# EAGLE design XC95144 (EAGLE 5.11)
PROJECT: XC95144XL Breakout Board
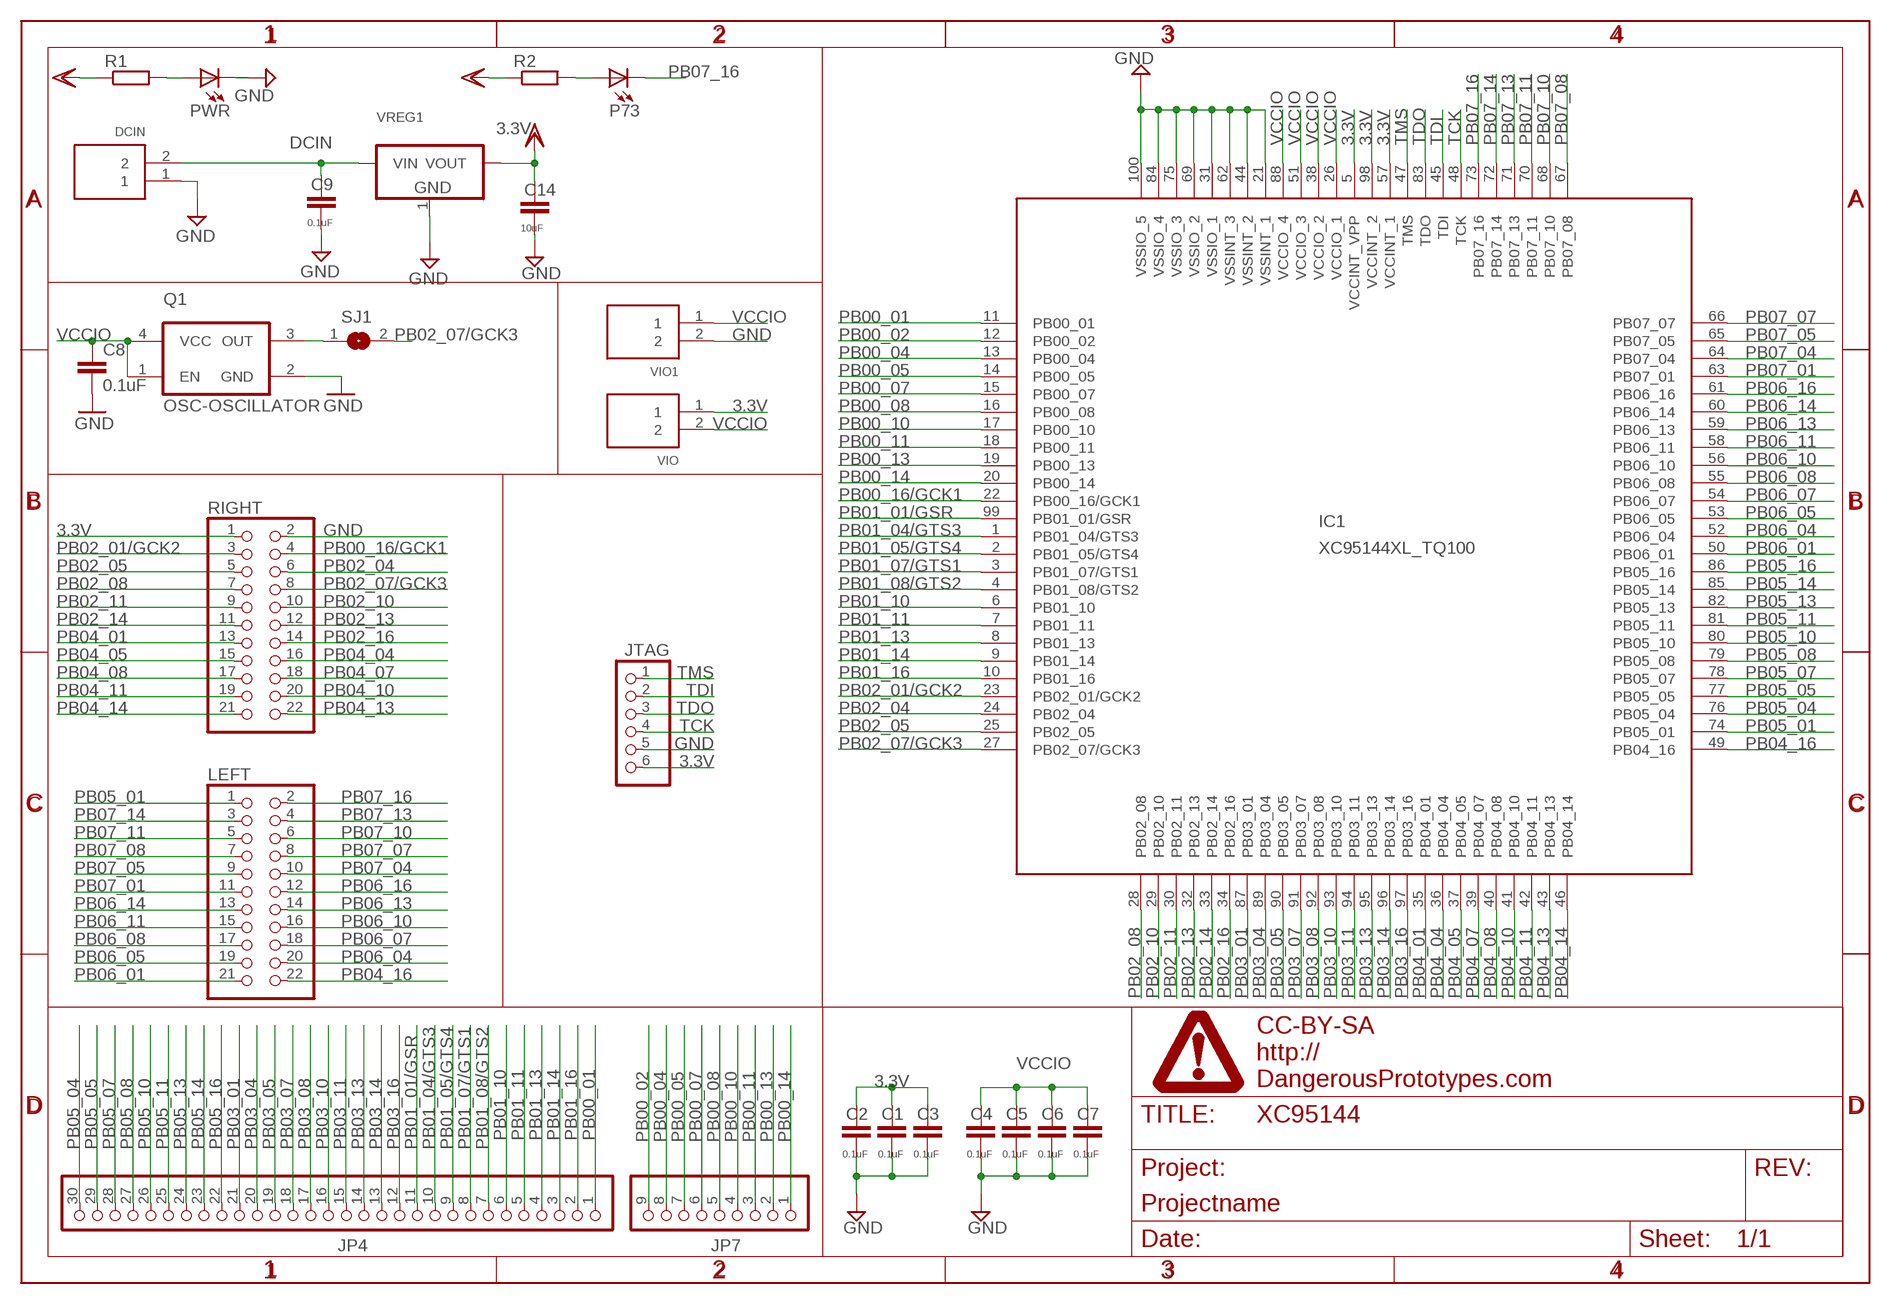
[diagram p0: schematic, sheet 1]

## Parts
C1  0.1uF  CAPC603  [C603]
C2  0.1uF  CAPC603  [C603]
C3  0.1uF  CAPC603  [C603]
C4  0.1uF  CAPC603  [C603]
C5  0.1uF  CAPC603  [C603]
C6  0.1uF  CAPC603  [C603]
C7  0.1uF  CAPC603  [C603]
C8  0.1uF  CAPC603  [C603]
C9  0.1uF  CAPC603  [C603]
C14  10uF  CAPC603  [C603]
DCIN  HEADER1X2PTH  [M1X2]
IC1  XC95144XL_TQ100  [XC-TQ100]
JP4  PINHD-1X30  [1X30]
JP7  PINHD-1X9  [1X09]
JTAG  PINHD-1X6  [1X06]
LEFT  PINHD-2X11  [2X11]
P73  P4  LEDCHIP-LED0805  [CHIP-LED0805]
PWR  P4  LEDCHIP-LED0805  [CHIP-LED0805]
Q1  OSC-OSCILLATOR  [OSCILLATOR_7X5_SMD]
R1  RESISTORR603  [R603]
R2  RESISTORR603  [R603]
RIGHT  PINHD-2X11  [2X11]
SJ1  SJ  [SJ]
U$1  DINA4_L  [DP_LOGO]
VIO  HEADER1X2PTH  [M1X2]
VIO1  HEADER1X2PTH  [M1X2]
VREG1  LD1117-3.3SOT223  [SOT223]

## Nets
3.3V: C1.1 C2.1 C3.1 C14.1 IC1.5(VCCINT_VPP) IC1.57(VCCINT_1) IC1.98(VCCINT_2) JTAG.6 R1.1 R2.1 RIGHT.1 VIO.1 VREG1.2(VOUT) ; supply symbol labelled VDD
DCIN: C9.1 DCIN.2 VREG1.3(VIN)
GND: C1.2 C2.2 C3.2 C4.2 C5.2 C6.2 C7.2 C8.2 C9.2 C14.2 DCIN.1 IC1.21(VSSINT_1) IC1.31(VSSIO_1) IC1.44(VSSINT_2) IC1.62(VSSINT_3) IC1.69(VSSIO_2) IC1.75(VSSIO_3) IC1.84(VSSIO_4) IC1.100(VSSIO_5) JTAG.5 PWR.C Q1.2(GND) RIGHT.2 VIO1.2 VREG1.1(GND)
N$1: PWR.A R1.2
N$2: P73.A R2.2
N$5: Q1.3(OUT) SJ1.1
PB00_01: IC1.11(PB00_01) JP4.1
PB00_02: IC1.12(PB00_02) JP7.9
PB00_04: IC1.13(PB00_04) JP7.8
PB00_05: IC1.14(PB00_05) JP7.7
PB00_07: IC1.15(PB00_07) JP7.6
PB00_08: IC1.16(PB00_08) JP7.5
PB00_10: IC1.17(PB00_10) JP7.4
PB00_11: IC1.18(PB00_11) JP7.3
PB00_13: IC1.19(PB00_13) JP7.2
PB00_14: IC1.20(PB00_14) JP7.1
PB00_16/GCK1: IC1.22(PB00_16/GCK1) RIGHT.4
PB01_01/GSR: IC1.99(PB01_01/GSR) JP4.11
PB01_04/GTS3: IC1.1(PB01_04/GTS3) JP4.10
PB01_05/GTS4: IC1.2(PB01_05/GTS4) JP4.9
PB01_07/GTS1: IC1.3(PB01_07/GTS1) JP4.8
PB01_08/GTS2: IC1.4(PB01_08/GTS2) JP4.7
PB01_10: IC1.6(PB01_10) JP4.6
PB01_11: IC1.7(PB01_11) JP4.5
PB01_13: IC1.8(PB01_13) JP4.4
PB01_14: IC1.9(PB01_14) JP4.3
PB01_16: IC1.10(PB01_16) JP4.2
PB02_01/GCK2: IC1.23(PB02_01/GCK2) RIGHT.3
PB02_04: IC1.24(PB02_04) RIGHT.6
PB02_05: IC1.25(PB02_05) RIGHT.5
PB02_07/GCK3: IC1.27(PB02_07/GCK3) RIGHT.8 SJ1.2
PB02_08: IC1.28(PB02_08) RIGHT.7
PB02_10: IC1.29(PB02_10) RIGHT.10
PB02_11: IC1.30(PB02_11) RIGHT.9
PB02_13: IC1.32(PB02_13) RIGHT.12
PB02_14: IC1.33(PB02_14) RIGHT.11
PB02_16: IC1.34(PB02_16) RIGHT.14
PB03_01: IC1.87(PB03_01) JP4.21
PB03_04: IC1.89(PB03_04) JP4.20
PB03_05: IC1.90(PB03_05) JP4.19
PB03_07: IC1.91(PB03_07) JP4.18
PB03_08: IC1.92(PB03_08) JP4.17
PB03_10: IC1.93(PB03_10) JP4.16
PB03_11: IC1.94(PB03_11) JP4.15
PB03_13: IC1.95(PB03_13) JP4.14
PB03_14: IC1.96(PB03_14) JP4.13
PB03_16: IC1.97(PB03_16) JP4.12
PB04_01: IC1.35(PB04_01) RIGHT.13
PB04_04: IC1.36(PB04_04) RIGHT.16
PB04_05: IC1.37(PB04_05) RIGHT.15
PB04_07: IC1.39(PB04_07) RIGHT.18
PB04_08: IC1.40(PB04_08) RIGHT.17
PB04_10: IC1.41(PB04_10) RIGHT.20
PB04_11: IC1.42(PB04_11) RIGHT.19
PB04_13: IC1.43(PB04_13) RIGHT.22
PB04_14: IC1.46(PB04_14) RIGHT.21
PB04_16: IC1.49(PB04_16) LEFT.22
PB05_01: IC1.74(PB05_01) LEFT.1
PB05_04: IC1.76(PB05_04) JP4.30
PB05_05: IC1.77(PB05_05) JP4.29
PB05_07: IC1.78(PB05_07) JP4.28
PB05_08: IC1.79(PB05_08) JP4.27
PB05_10: IC1.80(PB05_10) JP4.26
PB05_11: IC1.81(PB05_11) JP4.25
PB05_13: IC1.82(PB05_13) JP4.24
PB05_14: IC1.85(PB05_14) JP4.23
PB05_16: IC1.86(PB05_16) JP4.22
PB06_01: IC1.50(PB06_01) LEFT.21
PB06_04: IC1.52(PB06_04) LEFT.20
PB06_05: IC1.53(PB06_05) LEFT.19
PB06_07: IC1.54(PB06_07) LEFT.18
PB06_08: IC1.55(PB06_08) LEFT.17
PB06_10: IC1.56(PB06_10) LEFT.16
PB06_11: IC1.58(PB06_11) LEFT.15
PB06_13: IC1.59(PB06_13) LEFT.14
PB06_14: IC1.60(PB06_14) LEFT.13
PB06_16: IC1.61(PB06_16) LEFT.12
PB07_01: IC1.63(PB07_01) LEFT.11
PB07_04: IC1.64(PB07_04) LEFT.10
PB07_05: IC1.65(PB07_05) LEFT.9
PB07_07: IC1.66(PB07_07) LEFT.8
PB07_08: IC1.67(PB07_08) LEFT.7
PB07_10: IC1.68(PB07_10) LEFT.6
PB07_11: IC1.70(PB07_11) LEFT.5
PB07_13: IC1.71(PB07_13) LEFT.4
PB07_14: IC1.72(PB07_14) LEFT.3
PB07_16: IC1.73(PB07_16) LEFT.2 P73.C
TCK: IC1.48(TCK) JTAG.4
TDI: IC1.45(TDI) JTAG.2
TDO: IC1.83(TDO) JTAG.3
TMS: IC1.47(TMS) JTAG.1
VCCIO: C4.1 C5.1 C6.1 C7.1 C8.1 IC1.26(VCCIO_1) IC1.38(VCCIO_2) IC1.51(VCCIO_3) IC1.88(VCCIO_4) Q1.1(EN) Q1.4(VCC) VIO1.1 VIO.2

## Library data of the parts
C1-C9 C14 = dp_devices:CAP
DCIN VIO VIO1 = dp_devices:HEADER1X2
IC1 = XC:XC95144XL_TQ100: xc95144xl_tq100 edit this description Auto generated by make-symbol-device-package-bsdl.ulp Rev. 34 Source: xc95144xl_tq100.bsd
JP4 = pinhead:PINHD-1X30: PIN HEADER
JP7 = pinhead:PINHD-1X9: PIN HEADER
JTAG = pinhead:PINHD-1X6: PIN HEADER
LEFT RIGHT = pinhead:PINHD-2X11: PIN HEADER
P73 PWR = led:LED: LED OSRAM: - CHIPLED LG R971, LG N971, LY N971, LG Q971, LY Q971, LO R971, LY R971 LH N974, LH R974 LS Q976, LO Q976, LY Q976 LO Q996 - Hyper CHIPLED LW Q18S LB Q993, LB Q99A, LB R99A - SideLED LS A670, LO A670, LY A670, LG A670, LP A670 LB A673, LV A673, LT A673, LW A673 LH A674 LY A675 LS A676, LA A676, LO A676, LY A676, LW A676 LS A679, LY A679, LG A679 - Hyper Micro SIDELED® LS Y876, LA Y876, LO Y876, LY Y876 LT Y87S - SmartLED LW L88C, LW L88S LB L89C, LB L89S, LG L890 LS L89K, LO L89K, LY L89K LS L896, LA L896, LO L896, LY L896 - TOPLED LS T670, LO T670, LY T670, LG T670, LP T670 LSG T670, LSP T670, LSY T670, LOP T670, LYG T670 LG T671, LOG T671, LSG T671 LB T673, LV T673, LT T673, LW T673 LH T674 LS T676, LA T676, LO T676, LY T676, LB T676, LH T676, LSB T676, LW T676 LB T67C, LV T67C, LT T67C, LS T67K, LO T67K, LY T67K, LW E67C LS E67B, LA E67B, LO E67B, LY E67B, LB E67C, LV E67C, LT E67C LW T67C LS T679, LY T679, LG T679 LS T770, LO T770, LY T770, LG T770, LP T770 LB T773, LV T773, LT T773, LW T773 LH T774 LS E675, LA E675, LY E675, LS T675 LS T776, LA T776, LO T776, LY T776, LB T776 LHGB T686 LT T68C, LB T68C - Hyper Mini TOPLED® LB M676 - Mini TOPLED Santana® LG M470 LS M47K, LO M47K, LY M47K Source: http://www.osram.convergy.de LUXEON: - LUMILED® LXK2-PW12-R00, LXK2-PW12-S00, LXK2-PW14-U00, LXK2-PW14-V00 LXK2-PM12-R00, LXK2-PM12-S00, LXK2-PM14-U00 LXK2-PE12-Q00, LXK2-PE12-R00, LXK2-PE12-S00, LXK2-PE14-T00, LXK2-PE14-U00 LXK2-PB12-K00, LXK2-PB12-L00, LXK2-PB12-M00, LXK2-PB14-N00, LXK2-PB14-P00, LXK2-PB14-Q00 LXK2-PR12-L00, LXK2-PR12-M00, LXK2-PR14-Q00, LXK2-PR14-R00 LXK2-PD12-Q00, LXK2-PD12-R00, LXK2-PD12-S00 LXK2-PH12-R00, LXK2-PH12-S00 LXK2-PL12-P00, LXK2-PL12-Q00, LXK2-PL12-R00 Source: www.luxeon.com KINGBRIGHT: KA-3528ASYC Source: www.kingbright.com
Q1 = dp_devices:OSC-OSCILLATOR: Oscillator
R1 R2 = dp_devices:RESISTOR
SJ1 = jumper:SJ: SMD solder JUMPER
U$1 = dp_devices:DINA4_L: A4 DP frame Standard Dangerous Prototypes schematic frame. Automagically adds the DP logo and standard texts to the PCB Use the atrribute in the schematic editor to change the fields.; FF1: fulfillment by; FF2: Seeed Studio; FF3: www.seeedstudio.com; LICENSE: CC-BY-SA; PROJECT: Projectname; URL1: http://; URL2: DangerousPrototypes.com
VREG1 = dp_devices:LD1117-3.3

## Board
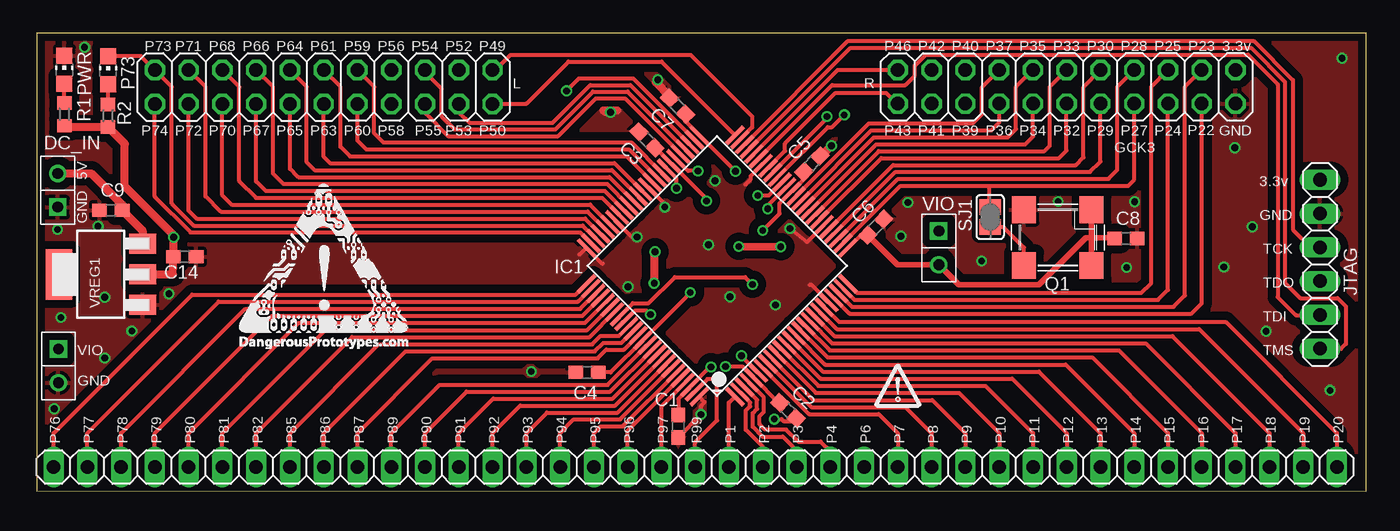
[diagram p1: board, top side]
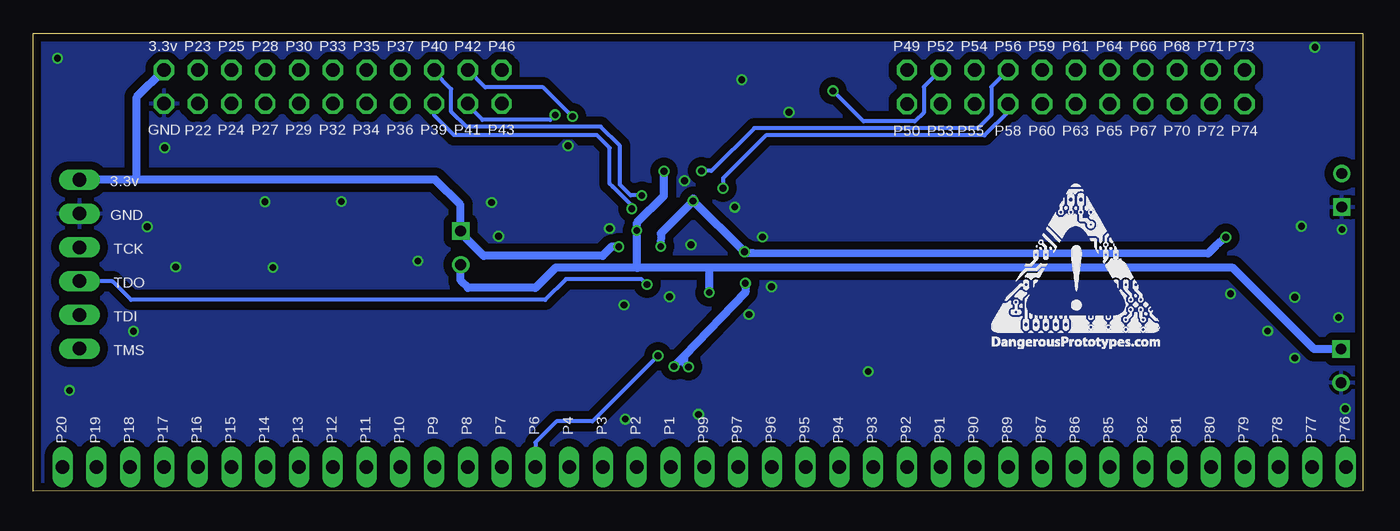
[diagram p2: board, bottom side, seen from below]

Size 100 x 34.43 mm. Coordinates in mm from the lower left corner, seen from the top.
Outline: 0.03,0.04 100,0 100,34.43 0,34.43 0.03,0.04
Copper layers (1*16): Top 0.035mm / dielectric 1.5mm / Bottom 0.035mm
Design rules "Fusion_eagle_rule_v1.1 *": minimum track width 6mil, minimum drill 12mil, track to track 6mil, track to pad 6mil, pad to pad 6mil, via to via 6mil, smd to smd 6mil, copper to edge 10mil, drill to drill 10mil, minimum pad ring 10mil, minimum via ring 6mil, stop-mask expansion 2mil, vias tented up to drill 100mil, thermal gap 10mil

### Footprints (pad centres in the part's own frame; a part is rotated, then mirrored left to right if it is on the bottom)
C603 = smd 1.1 x 1: 1 -0.85,0; 2 0.85,0
M1X2 = drill 0.8 square: 1 -1.27,0 | drill 0.8 round: 2 1.27,0
XC-TQ100 = smd 1.8 x 0.3: 1 -7.9,6; 2 -7.9,5.5; 3 -7.9,5; 4 -7.9,4.5; 5 -7.9,4; 6 -7.9,3.5; 7 -7.9,3; 8 -7.9,2.5; 9 -7.9,2; 10 -7.9,1.5; 11 -7.9,1; 12 -7.9,0.5; 13 -7.9,0; 14 -7.9,-0.5; 15 -7.9,-1; 16 -7.9,-1.5; 17 -7.9,-2; 18 -7.9,-2.5; 19 -7.9,-3; 20 -7.9,-3.5; 21 -7.9,-4; 22 -7.9,-4.5; 23 -7.9,-5; 24 -7.9,-5.5; 25 -7.9,-6; 51 7.9,-6; 52 7.9,-5.5; 53 7.9,-5; 54 7.9,-4.5; 55 7.9,-4; 56 7.9,-3.5; 57 7.9,-3; 58 7.9,-2.5; 59 7.9,-2; 60 7.9,-1.5; 61 7.9,-1; 62 7.9,-0.5; 63 7.9,0; 64 7.9,0.5; 65 7.9,1; 66 7.9,1.5; 67 7.9,2; 68 7.9,2.5; 69 7.9,3; 70 7.9,3.5; 71 7.9,4; 72 7.9,4.5; 73 7.9,5; 74 7.9,5.5; 75 7.9,6 | smd 0.3 x 1.8: 26 -6,-7.9; 27 -5.5,-7.9; 28 -5,-7.9; 29 -4.5,-7.9; 30 -4,-7.9; 31 -3.5,-7.9; 32 -3,-7.9; 33 -2.5,-7.9; 34 -2,-7.9; 35 -1.5,-7.9; 36 -1,-7.9; 37 -0.5,-7.9; 38 0,-7.9; 39 0.5,-7.9; 40 1,-7.9; 41 1.5,-7.9; 42 2,-7.9; 43 2.5,-7.9; 44 3,-7.9; 45 3.5,-7.9; 46 4,-7.9; 47 4.5,-7.9; 48 5,-7.9; 49 5.5,-7.9; 50 6,-7.9; 76 6,7.9; 77 5.5,7.9; 78 5,7.9; 79 4.5,7.9; 80 4,7.9; 81 3.5,7.9; 82 3,7.9; 83 2.5,7.9; 84 2,7.9; 85 1.5,7.9; 86 1,7.9; 87 0.5,7.9; 88 0,7.9; 89 -0.5,7.9; 90 -1,7.9; 91 -1.5,7.9; 92 -2,7.9; 93 -2.5,7.9; 94 -3,7.9; 95 -3.5,7.9; 96 -4,7.9; 97 -4.5,7.9; 98 -5,7.9; 99 -5.5,7.9; 100 -6,7.9
1X30 = drill 1.016 long: 1 -36.83,0; 2 -34.29,0; 3 -31.75,0; 4 -29.21,0; 5 -26.67,0; 6 -24.13,0; 7 -21.59,0; 8 -19.05,0; 9 -16.51,0; 10 -13.97,0; 11 -11.43,0; 12 -8.89,0; 13 -6.35,0; 14 -3.81,0; 15 -1.27,0; 16 1.27,0; 17 3.81,0; 18 6.35,0; 19 8.89,0; 20 11.43,0; 21 13.97,0; 22 16.51,0; 23 19.05,0; 24 21.59,0; 25 24.13,0; 26 26.67,0; 27 29.21,0; 28 31.75,0; 29 34.29,0; 30 36.83,0
1X09 = drill 1.016 long: 1 -10.16,0; 2 -7.62,0; 3 -5.08,0; 4 -2.54,0; 5 0,0; 6 2.54,0; 7 5.08,0; 8 7.62,0; 9 10.16,0
1X06 = drill 1.016 long: 1 -6.35,0; 2 -3.81,0; 3 -1.27,0; 4 1.27,0; 5 3.81,0; 6 6.35,0
2X11 = drill 1.016 octagon: 1 -12.7,-1.27; 2 -12.7,1.27; 3 -10.16,-1.27; 4 -10.16,1.27; 5 -7.62,-1.27; 6 -7.62,1.27; 7 -5.08,-1.27; 8 -5.08,1.27; 9 -2.54,-1.27; 10 -2.54,1.27; 11 0,-1.27; 12 0,1.27; 13 2.54,-1.27; 14 2.54,1.27; 15 5.08,-1.27; 16 5.08,1.27; 17 7.62,-1.27; 18 7.62,1.27; 19 10.16,-1.27; 20 10.16,1.27; 21 12.7,-1.27; 22 12.7,1.27
CHIP-LED0805 = smd 1.2 x 1.2: A 0,-1.05; C 0,1.05
OSCILLATOR_7X5_SMD = smd 1.8 x 2: 1 -2.54,-2.1; 2 2.54,-2.1; 3 2.54,2.1; 4 -2.54,2.1
R603 = smd 1 x 1.1: 1 -0.85,0; 2 0.85,0
SJ = smd 1.168 x 1.6: 1 -0.762,0; 2 0.762,0
SOT223 = smd 1.5 x 2: 1 -2.3,-3.15; 2 0,-3.15; 3 2.3,-3.15 | smd 3.8 x 2: 4 0,3.15

### Placement (x,y rotation side)
C1  48.26,4.88 270 top
C2  56.52,6.07 316.5 top
C3  45.9,26.42 135 top
C4  41.4,8.94 180 top
C5  58.31,24.61 44.8 top
C6  63.11,19.86 45 top
C7  48.2,28.96 135 top
C8  81.93,19 0 top
C9  5.59,21.13 180 top
C14  11.15,17.63 0 top
DCIN  1.59,22.63 90 top
IC1  51.18,16.94 135 top
JP4  38.1,1.83 180 top
JP7  87.63,1.83 180 top
JTAG  96.52,17.07 90 top
LEFT  21.59,30.39 0 top
P73  5.37,31.66 0 top
PWR  2.08,31.7 0 top
Q1  76.8,19.06 180 top
R1  2.08,28.33 90 top
R2  5.37,28.23 90 top
RIGHT  77.47,30.4 180 top
SJ1  71.72,20.61 90 top
U$1  64.77,6.91 0 top
U$2  [DP_LOGO_ART_0.5X0.5]  15.24,10.72 0 top
U$3  [DP_LOGO_ART_0.5X0.5]  27.94,10.72 0 bottom
VIO  67.86,18.3 270 top
VIO1  1.64,9.42 270 top
VREG1  4.83,16.31 90 top

### Tracks (layer width: path | path; a pad name or v marks a point on that pad's centre or on a via)
3.3V  (via drill 0.51)
  Top 0.305: C1.1 48.26,6.95 IC1.98 50.66,9.35 v50.72,9.35 | C2.1 55.81,6.66 IC1.5 53.08,9.39 v51.8,9.39 | C3.1 46.55,25.81 IC1.57 50.38,21.99 v50.38,21.82
  Top 0.61: v46.44,15.63 46.44,17.93 v46.52,18 | v52.81,18.4 v55.97,18.39 | R2.1 5.47,27.28 | R2.1 2.18,27.38 R1.1 | VREG1.2 10.25,16.31 C14.1 v10.3,19.1 10.3,19.25 6.63,22.92 6.63,26.12 R2.1
  Bottom 0.61: 46.41,17.9 45.9,17.89 11.66,17.86 11.06,18.45 v10.3,19.1 | 46.41,17.9 v46.52,18 | v46.52,18 v50.38,21.82 | 92.2,23.42 69.76,23.42 67.87,21.53 67.87,19.58 VIO.1 67.86,19.43 66.13,17.7 57.17,17.7 56.49,18.39 v55.97,18.39 | 92.2,23.42 JTAG.6 | 51.04,10.15 51.04,9.66 v50.72,9.35 | 51.04,10.15 51.04,10.16 46.44,14.95 v46.44,15.63 | 51.04,10.15 v51.8,9.39 | v46.52,18 46.41,17.9 | v50.38,21.82 50.38,21.81 52.79,19.39 v52.81,18.4 | v50.38,21.82 50.38,21.99 | RIGHT.1 92.2,29.64 92.2,23.42
DCIN
  Top 0.61: 7.96,18.59 VREG1.3 7.98,19.59 C9.1 6.44,21.55 4.09,23.9 DCIN.2
GND  (via drill 0.51)
  Top 0.305: IC1.84 45.01,13.6 45.85,13.6 v46.16,13.28 | IC1.31 57.92,18.73 v56.66,19.75 | IC1.21 58.27,15.51 58.14,15.51 | IC1.100 50.24,6.71 50.24,6.69 49.97,6.43 v49.97,5.78 48.26,4.06 C1.2 | C2.2 56.92,5.27 56.19,5.27 56.03,5.42 v55.47,5.42 | IC1.75 41.34,18.29 | 41.34,18.29 40.83,17.78 | 41.34,18.29 42.52,17.11 42.6,17.11 | IC1.69 44.77,19.11 v45.15,19.11 | IC1.62 47.24,21.59 v47.24,21.36 | IC1.44 53.71,23.71 53.71,23.46 53.33,23.08 53.3,23.08
  Top 0.61: C3.2 45.19,27.13 | 46.74,30.86 46.61,30.73 46.57,30.73 47.59,29.71 C7.2 | C5.2 59.02,25.21 v59.78,25.97 | 43.69,28.63 42.63,28.63 42.76,28.5 v43.16,28.5
  other vias: 37.2,9 50.53,18.53 44.49,15.38 52.15,14.63 65.01,19.18 65.53,21.7 76.82,21.78 81.98,16.83 82.58,21.77 55.58,14.01 90.11,25.83 91.43,19.89 92.47,12.03 46.71,30.94 89.28,16.87 98.18,32.55 97.27,7.58 3.61,33.39 51.03,23.34 71.07,17.31 1.57,19.67 4.62,19.93 5.13,14.59 1.83,13.07 7.16,12.05 5.13,10.02 1.32,6.21 9.96,14.85
  pour Top (isolate 0.61): 0,-0.46 100.08,-0.46 99.95,34.59 0,34.59
  pour Bottom (isolate 0.61): 0,-0.71 100,-0.71 100,34.21 0,34.21
  pour Bottom: 60.4,25.9 60.4,26.02 60.11,26.31 59.49,26.31 59.19,26.02 59.19,25.91 60.39,25.91
  pour Top: 36.56,9.11 36.91,9.45 37.34,9.45 37.74,9.04 37.74,8.78 37.6,8.64 36.91,8.64 36.56,8.98
N$1
  Top 0.305: R1.2 PWR.A
N$2
  Top 0.305: R2.2 P73.A
N$5
  Top 0.305: SJ1.1 72.72,19.85 74.26,18.31 Q1.3
PB00_01
  Top 0.305: IC1.11 58.78,7.92 71.37,7.92 74.93,4.37 JP4.1
PB00_02
  Top 0.305: IC1.12 58.96,8.46 73.38,8.46 77.47,4.37 JP7.9
PB00_04
  Top 0.305: IC1.13 59.13,8.99 75.39,8.99 80.01,4.37 JP7.8
PB00_05
  Top 0.305: IC1.14 59.3,9.52 77.39,9.52 82.55,4.37 JP7.7
PB00_07
  Top 0.305: IC1.15 59.48,10.06 79.4,10.06 85.09,4.37 JP7.6
PB00_08
  Top 0.305: IC1.16 59.65,10.59 81.41,10.59 87.63,4.37 JP7.5
PB00_10
  Top 0.305: IC1.17 59.83,11.12 83.41,11.12 90.17,4.37 JP7.4
PB00_11
  Top 0.305: IC1.18 60,11.66 85.42,11.66 92.71,4.37 JP7.3
PB00_13
  Top 0.305: IC1.19 60.17,12.19 87.43,12.19 95.25,4.37 JP7.2
PB00_14
  Top 0.305: IC1.20 60.35,12.73 89.43,12.73 97.79,4.37 JP7.1
PB00_16/GCK1
  Top 0.305: IC1.22 61.14,13.35 86.86,13.35 87.63,14.12 RIGHT.4
PB01_01/GSR
  Top 0.305: IC1.99 50.45,8.43 50.85,8.43 51.18,8.1 51.18,5.33 49.53,3.68 JP4.11
PB01_04/GTS3
  Top 0.305: IC1.1 52.07,6.66 JP4.10
PB01_05/GTS4
  Top 0.305: IC1.2 53.66,6.69 53.66,6.39 53.34,6.07 53.34,4.62 54.61,3.35 JP4.9
PB01_07/GTS1
  Top 0.305: IC1.3 54.18,6.87 54.18,6.18 53.86,5.87 53.86,4.84 54.59,4.11 56.12,4.11 57.15,3.09 JP4.8
PB01_08/GTS2
  Top 0.305: IC1.4 54.7,7.06 54.7,5.97 54.38,5.65 54.38,5.04 54.79,4.64 56.38,4.64 57.29,3.72 58.97,3.72 59.69,3 JP4.7
PB01_10  (via drill 0.51)
  Top 0.305: IC1.6 53.01,10.16 v53.01,10.19
  Bottom 0.305: v53.01,10.19 57.95,5.24 60.66,5.24 62.23,3.67 JP4.6
PB01_11
  Top 0.305: IC1.7 58.09,5.79 63.35,5.79 64.77,4.37 JP4.5
PB01_13
  Top 0.305: IC1.8 58.26,6.32 65.35,6.32 67.31,4.37 JP4.4
PB01_14
  Top 0.305: IC1.9 58.44,6.86 67.36,6.86 69.85,4.37 JP4.3
PB01_16
  Top 0.305: IC1.10 58.61,7.39 69.37,7.39 72.39,4.37 JP4.2
PB02_01/GCK2
  Top 0.305: IC1.23 61.33,13.87 85.5,13.87 86.36,14.73 86.36,30.4 RIGHT.3
PB02_04
  Top 0.305: IC1.24 61.51,14.39 84.34,14.39 85.09,15.14 RIGHT.6
PB02_05
  Top 0.305: IC1.25 61.7,14.91 83.08,14.91 83.82,15.65 83.82,30.4 RIGHT.5
PB02_07/GCK3
  Top 0.305: IC1.27 64.98,22.96 71.61,22.96 | 71.61,22.96 82.09,22.96 82.55,23.42 RIGHT.8 | SJ1.2 71.61,21.48 71.61,22.96
PB02_08
  Top 0.305: RIGHT.7 81.28,30.4 81.28,24.16 80.61,23.48 64.79,23.48 IC1.28
PB02_10
  Top 0.305: IC1.29 64.61,24 79.22,24 80.01,24.79 RIGHT.10
PB02_11
  Top 0.305: IC1.30 64.42,24.52 78.14,24.52 78.73,25.11 78.73,30.39 RIGHT.9
PB02_13
  Top 0.305: IC1.32 63.53,25.04 76.89,25.04 77.46,25.62 77.46,29.12 RIGHT.12
PB02_14
  Top 0.305: RIGHT.11 76.2,30.4 76.2,25.96 75.81,25.56 63.34,25.56 IC1.33
PB02_16
  Top 0.305: IC1.34 63.15,26.09 74.35,26.09 74.93,26.67 RIGHT.14
PB03_01
  Top 0.305: JP4.21 24.13,4.37 29.76,9.99 42.19,9.99 42.84,10.64 44.17,10.64 IC1.87
PB03_04
  Top 0.305: JP4.20 26.67,4.37 30.3,8 42.95,8 IC1.89
PB03_05
  Top 0.305: JP4.19 29.21,4.37 32.32,7.48 43.13,7.48 IC1.90
PB03_07
  Top 0.305: JP4.18 31.75,4.37 34.34,6.96 43.32,6.96 IC1.91
PB03_08
  Top 0.305: JP4.17 34.29,4.37 36.36,6.44 43.51,6.44 IC1.92
PB03_10
  Top 0.305: JP4.16 36.83,4.37 38.38,5.92 43.69,5.92 IC1.93
PB03_11
  Top 0.305: JP4.15 39.37,4.37 40.4,5.4 43.88,5.4 IC1.94
PB03_13
  Top 0.305: JP4.14 41.91,4.37 42.42,4.88 44.07,4.88 IC1.95
PB03_14
  Top 0.305: IC1.96 44.45,4.55 JP4.13
PB03_16
  Top 0.305: IC1.97 46.99,6.39 JP4.12
PB04_01
  Top 0.305: RIGHT.13 73.66,30.4 73.66,27.23 73.04,26.61 62.97,26.61 IC1.35
PB04_04
  Top 0.305: IC1.36 62.78,27.13 71.79,27.13 72.39,27.72 RIGHT.16
PB04_05
  Top 0.305: IC1.37 62.59,27.65 70.41,27.65 71.11,28.35 71.11,30.39 RIGHT.15
PB04_07  (via drill 0.51)
  Top 0.305: IC1.39 54.98,21.45 v54.98,21.25
  Bottom 0.305: 54.98,21.45 v54.98,21.25 54.98,21.45 IC1.39 56.66,23.12 56.66,25.82 57.61,26.77 68.36,26.77 69.85,28.26 RIGHT.18
PB04_08  (via drill 0.51)
  Top 0.305: IC1.40 55.06,22.24 v54.23,22.24
  Bottom 0.305: v54.23,22.24 55.07,22.24 55.88,23.05 55.88,25.96 57.33,27.41 67.42,27.41 68.57,28.55 68.57,30.24 69.85,31.52 RIGHT.17
PB04_10  (via drill 0.51)
  Top 0.305: IC1.41 59.5,27.38 59.83,27.38 v60.74,28.3
  Bottom 0.305: RIGHT.20 67.31,29.01 66.22,27.91 61.12,27.91 v60.74,28.3
PB04_11  (via drill 0.51)
  Top 0.305: IC1.42 59.45,28.04 v59.45,28.17
  Bottom 0.305: v59.45,28.17 61.65,30.37 66,30.37 RIGHT.19
PB04_13
  Top 0.305: IC1.43 56.3,25.6 56.3,26.16 60.08,29.95 63.89,29.95 64.71,29.13 RIGHT.22
PB04_14
  Top 0.305: IC1.46 60.26,31.67 RIGHT.21
PB04_16
  Top 0.305: 34.3,31.66 LEFT.22 34.49,31.66 35.64,32.8 49.19,32.8 53.81,28.18 53.81,27.35 IC1.49
PB05_01
  Top 0.305: IC1.74 40.89,19.46 11.58,19.46 8.89,22.15 LEFT.1 8.89,29.13
PB05_04
  Top 0.305: IC1.76 40.54,14.78 11.68,14.78 1.27,4.37 JP4.30
PB05_05
  Top 0.305: IC1.77 40.71,14.25 13.69,14.25 3.81,4.37 JP4.29
PB05_07
  Top 0.305: IC1.78 40.88,13.72 15.7,13.72 6.35,4.37 JP4.28
PB05_08
  Top 0.305: IC1.79 41.06,13.18 17.7,13.18 8.89,4.37 JP4.27
PB05_10
  Top 0.305: IC1.80 41.23,12.65 19.71,12.65 11.43,4.37 JP4.26
PB05_11
  Top 0.305: IC1.81 41.41,12.12 21.72,12.12 13.97,4.37 JP4.25
PB05_13
  Top 0.305: IC1.82 41.58,11.58 23.72,11.58 16.51,4.37 JP4.24
PB05_14
  Top 0.305: JP4.23 19.05,4.37 25.73,11.05 41.78,11.05 42.42,11.68 43.8,11.68 IC1.85
PB05_16
  Top 0.305: JP4.22 21.59,4.37 27.74,10.52 41.97,10.52 42.62,11.16 43.99,11.16 IC1.86
PB06_01
  Top 0.305: IC1.50 47,32.3 39.99,32.3 36.83,29.13 34.3,29.13 LEFT.21
PB06_04  (via drill 0.51)
  Top 0.305: IC1.52 44.86,31.04 40.79,31.04 v39.85,30.1
  Bottom 0.305: v39.85,30.1 37.55,27.8 33.69,27.8 33.02,28.47 33.02,30.4 31.76,31.66 LEFT.20
PB06_05
  Top 0.305: IC1.53 44.66,30.53 41.63,30.53 38.79,27.69 32.56,27.69 31.75,28.5 LEFT.19
PB06_07
  Top 0.305: IC1.54 44.45,30.04 41.85,30.04 39.01,27.2 31.42,27.2 30.47,28.16 30.47,30.25 29.21,31.51 LEFT.18
PB06_08
  Top 0.305: IC1.55 44.25,29.53 42.06,29.53 39.23,26.7 30.96,26.7 29.21,28.45 LEFT.17
PB06_10  (via drill 0.51)
  Top 0.305: IC1.56 48.99,24.08 v49.73,24.08
  Bottom 0.305: v49.73,24.08 49,24.08 45.77,27.3 28.94,27.3 27.94,28.31 27.94,30.4 26.68,31.66 LEFT.16
PB06_11  (via drill 0.51)
  Top 0.305: IC1.58 48.12,23.54 v48.12,22.77
  Bottom 0.305: v48.12,22.77 48.12,23.53 44.91,26.75 28.45,26.75 26.67,28.52 LEFT.15
PB06_13
  Top 0.305: LEFT.14 24.14,31.66 25.4,30.4 25.4,26.9 26.07,26.23 44.73,26.23 IC1.59
PB06_14
  Top 0.305: LEFT.13 24.13,26.36 24.79,25.7 44.54,25.7 IC1.60
PB06_16
  Top 0.305: LEFT.12 21.6,31.66 22.86,30.4 22.86,25.9 23.57,25.18 44.35,25.18 IC1.61
PB07_01
  Top 0.305: LEFT.11 21.59,25.13 22.06,24.66 43.46,24.66 IC1.63
PB07_04
  Top 0.305: LEFT.10 19.06,31.66 20.32,30.4 20.32,24.73 20.9,24.14 43.27,24.14 IC1.64
PB07_05
  Top 0.305: LEFT.9 19.05,24.24 19.67,23.62 43.09,23.62 IC1.65
PB07_07
  Top 0.305: LEFT.8 16.52,31.66 17.78,30.4 17.78,23.88 18.55,23.1 42.9,23.1 IC1.66
PB07_08
  Top 0.305: LEFT.7 16.51,23.3 17.23,22.58 42.71,22.58 IC1.67
PB07_10
  Top 0.305: LEFT.6 13.98,31.66 15.24,30.4 15.24,23.32 16.5,22.06 42.53,22.06 IC1.68
PB07_11
  Top 0.305: LEFT.5 13.97,22.24 14.67,21.54 41.63,21.54 IC1.70
PB07_13
  Top 0.305: LEFT.4 11.44,31.66 12.7,30.4 12.7,22.17 13.86,21.02 41.45,21.02 IC1.71
PB07_14
  Top 0.305: LEFT.3 11.43,21.09 12.03,20.5 41.26,20.5 IC1.72
PB07_16
  Top 0.305: IC1.73 41.08,19.98 11.81,19.98 10.16,21.63 10.16,30.4 8.91,31.65 LEFT.2 7.84,32.71 P73.C 5.59,32.93
TCK
  Top 0.305: JTAG.4 95.82,18.34 94.49,19.67 94.49,30.91 91.54,33.86 61.03,33.86 IC1.48
TDI
  Top 0.305: JTAG.2 97.77,13.23 94.7,13.23 93.34,14.59 93.34,30.59 91.12,32.82 66.88,32.82 66.05,31.99 66.05,31.24 65.34,30.53 59.82,30.53 IC1.45
TDO  (via drill 0.51)
  Top 0.305: IC1.83 44.84,14.13 46.04,14.13 48.01,16.1 53.29,16.1 v53.85,15.54
  Bottom 0.305: JTAG.3 97.77,15.77 94.03,15.77 92.65,14.39 61.51,14.39 59.94,15.95 54.25,15.95 v53.85,15.54
TMS
  Top 0.305: JTAG.1 97.8,10.71 98.09,10.71 98.46,11.07 98.46,13.91 97.85,14.52 95.05,14.52 93.89,15.67 93.89,30.78 91.34,33.34 61.21,33.34 IC1.47
VCCIO  (via drill 0.51)
  Top 0.305: C4.1 43.18,8.94 IC1.88 v49.16,14.93 | IC1.26 61.99,19.26 C6.1 | C7.1 48.8,27.81 IC1.51 52.55,24.05 v52.56,24.05 | 54.57,19.61 v54.61,19.61 55.88,20.88 55.88,21.64 IC1.38 57.96,23.72 C5.1
  Top 0.406: 79.34,19.05 Q1.4 | 79.34,19.05 Q1.1 | C8.1 81.03,19.05 79.34,19.05 | C6.1 64.74,17.03 VIO.2 69.38,15.51 75.37,15.51 78.92,19.05 79.34,19.05
  Bottom 0.305: v54.61,19.61 54.57,19.65 54.57,20.21
  Bottom 0.61: 49,16.79 54.57,16.79 | 67.61,16.79 VIO.2 67.86,15.84 67.31,15.29 62.23,15.29 60.71,16.81 54.6,16.81 54.57,16.79 | v49.16,14.93 49.16,16.62 49,16.79 | 54.57,16.79 54.57,20.21 52.56,22.21 v52.56,24.05 | 49,16.79 9.77,16.79 3.67,10.69 VIO1.1

### Text on the board
tNames: P73 | P71 | P68 | P66 | P64 | P61 | P59 | P56 | P54 | P52 | P49 | P46 | P42 | P40 | P37 | P35 | P33 | P30 | P28 | P25 | P23 | 3.3v | L | R | DC_IN | P74 | P72 | P70 | P67 | P65 | P63 | P60 | P58 | P55 | P53 | P50 | P43 | P41 | P39 | P36 | P34 | P32 | P29 | P27 | P24 | P22 | GND | GCK3 | 5V | 3.3v | GND | GND | TCK | TDO | TDI | VIO | TMS | GND | P76 | P77 | P78 | P79 | P80 | P81 | P82 | P85 | P86 | P87 | P89 | P90 | P91 | P92 | P93 | P94 | P95 | P96 | P97 | P99 | P1 | P2 | P3 | P4 | P6 | P7 | P8 | P9 | P10 | P11 | P12 | P13 | P14 | P15 | P16 | P17 | P18 | P19 | P20
bNames: P73 | P71 | P68 | P66 | P64 | P61 | P59 | P56 | P54 | P52 | P49 | P46 | P42 | P40 | P37 | P35 | P33 | P30 | P28 | P25 | P23 | 3.3v | P74 | P72 | P70 | P67 | P65 | P63 | P60 | P58 | P55 | P53 | P50 | P43 | P41 | P39 | P36 | P34 | P32 | P29 | P27 | P24 | P22 | GND | 3.3v | GND | TCK | TDO | TDI | TMS | P76 | P77 | P78 | P79 | P80 | P81 | P82 | P85 | P86 | P87 | P89 | P90 | P91 | P92 | P93 | P94 | P95 | P96 | P97 | P99 | P1 | P2 | P3 | P4 | P6 | P7 | P8 | P9 | P10 | P11 | P12 | P13 | P14 | P15 | P16 | P17 | P18 | P19 | P20